# Altium schematic sheet Microcontroller.SchDoc
size A; Organization: Machine Intelligence Laboratory; Address1: 1889 Museum Rd; Address2: Room 3001; Address3: Gainesville, FL, 32611; SheetNumber: 3; SheetTotal: 4
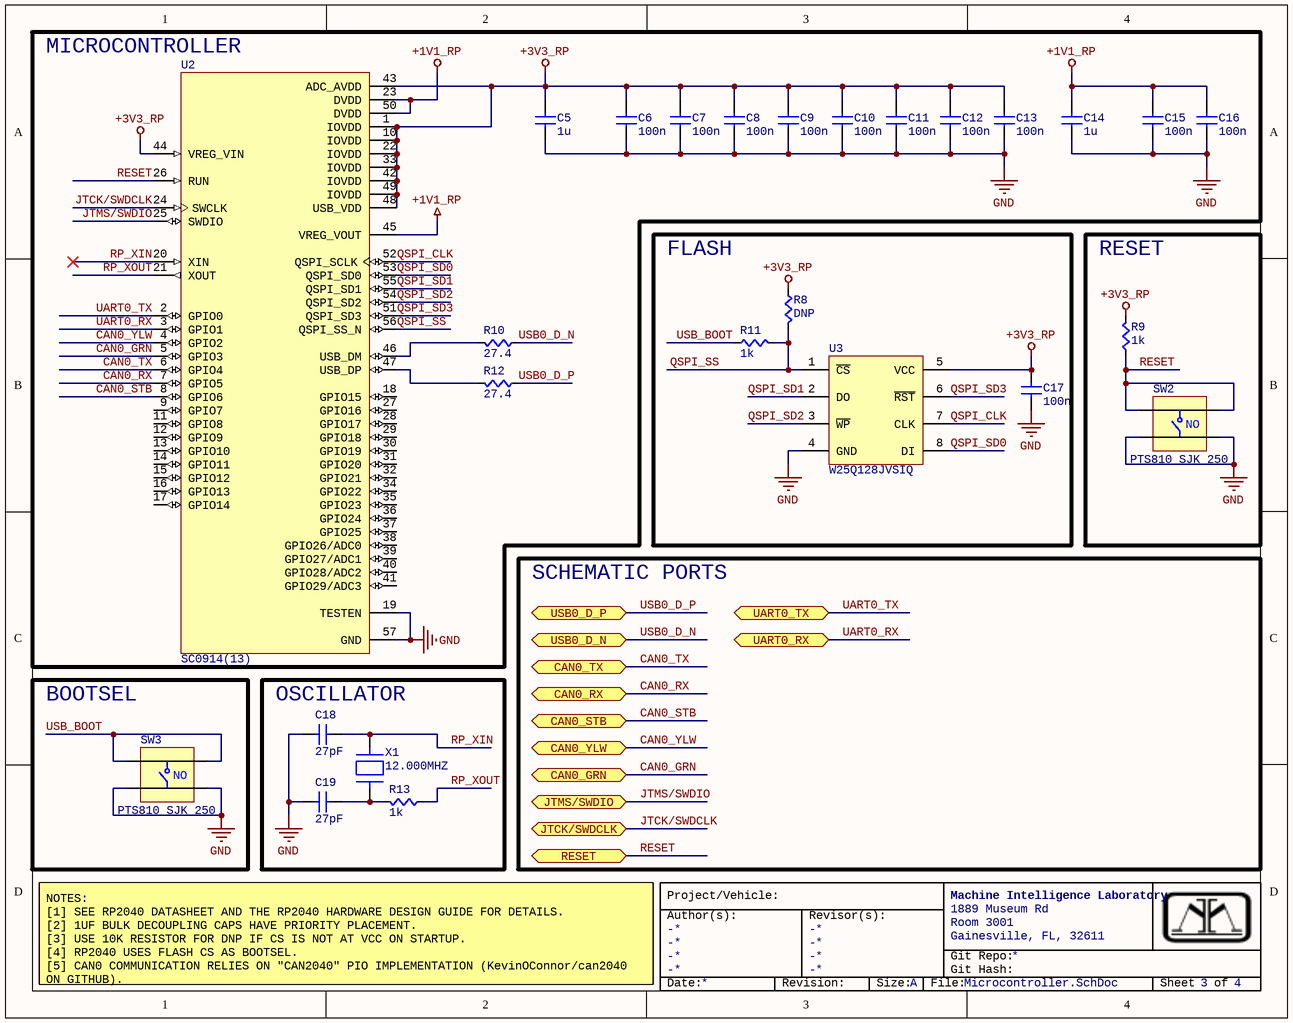
[diagram p0: Microcontroller.SchDoc]

## Parts
C5  value 1u  [CAPC0805]  (hidden comment: Cap)
C6  value 100n  [CAPC0805]  (hidden comment: Cap)
C7  value 100n  [CAPC0805]  (hidden comment: Cap)
C8  value 100n  [CAPC0805]  (hidden comment: Cap)
C9  value 100n  [CAPC0805]  (hidden comment: Cap)
C10  value 100n  [CAPC0805]  (hidden comment: Cap)
C11  value 100n  [CAPC0805]  (hidden comment: Cap)
C12  value 100n  [CAPC0805]  (hidden comment: Cap)
C13  value 100n  [CAPC0805]  (hidden comment: Cap)
C14  value 1u  [CAPC0805]  (hidden comment: Cap)
C15  value 100n  [CAPC0805]  (hidden comment: Cap)
C16  value 100n  [CAPC0805]  (hidden comment: Cap)
C17  value 100n  [CAPC0805]  (hidden comment: Cap)
C18  value 27pF  [CAPC0805]  (hidden comment: Cap)
C19  value 27pF  [CAPC0805]  (hidden comment: Cap)
R8  value DNP  [RES0805]  (hidden comment: Res)
R9  value 1k  [RES0805]  (hidden comment: Res)
R10  value 27.4  [RES0805]  (hidden comment: Res)
R11  value 1k  [RES0805]  (hidden comment: Res)
R12  value 27.4  [RES0805]  (hidden comment: Res)
R13  value 1k  [RES0805]  (hidden comment: Res)
SW2  PTS810 SJK 250  [SW_PTS810_SJM_250_SMTR_LFS]
SW3  PTS810 SJK 250  [SW_PTS810_SJM_250_SMTR_LFS]
U2  SC0914(13)  [QFN40P700X700X90-57N]
U3  W25Q128JVSIQ  [SOIC127P790X216-8N]
X1  12.000MHZ  [ABLS-12.000MHZ]

## Blocks framed on the sheet
MICROCONTROLLER: C5-C16 R10 R12 U2
FLASH: C17 R8 R11 U3
RESET: R9 SW2
BOOTSEL: SW3
OSCILLATOR: C18 C19 R13 X1

## Ports
CAN0_GRN (bidir, see Connectors[5D]), CAN0_RX (bidir, see Transcievers[1C]), CAN0_STB (bidir, see Transcievers[1D]), CAN0_TX (bidir, see Transcievers[1C]), CAN0_YLW (bidir, see Connectors[5D]), JTCK/SWDCLK (bidir, see Connectors[5D]), JTMS/SWDIO (bidir, see Connectors[5D]), RESET (bidir, see Transcievers[1D]), UART0_RX (bidir, see Transcievers[1C]), UART0_TX (bidir, see Transcievers[1C]), USB0_D_N (bidir, see Connectors[5E]), USB0_D_P (bidir, see Connectors[5E])

## Nets
+1V1_RP: C14.1(A) C15.1(A) C16.1(A) U2.23(DVDD) U2.45(VREG_VOUT) U2.50(DVDD)
+3V3_RP: C5.1(A) C6.1(A) C7.1(A) C8.1(A) C9.1(A) C10.1(A) C11.1(A) C12.1(A) C13.1(A) C17.1(A) R8.2(B) R9.1(A) U2.1(IOVDD) U2.10(IOVDD) U2.22(IOVDD) U2.33(IOVDD) U2.42(IOVDD) U2.43(ADC_AVDD) U2.44(VREG_VIN) U2.48(USB_VDD) U2.49(IOVDD) U3.5(VCC)
GND: C5.2(B) C6.2(B) C7.2(B) C8.2(B) C9.2(B) C10.2(B) C11.2(B) C12.2(B) C13.2(B) C14.2(B) C15.2(B) C16.2(B) C17.2(B) C18.1(A) C19.1(A) SW2.3 SW2.4 SW3.3 SW3.4 U2.19(TESTEN) U2.57(GND) U3.4(GND)
CAN0_GRN: U2.5(GPIO3) ; port CAN0_GRN
CAN0_RX: U2.7(GPIO5) ; port CAN0_RX
CAN0_STB: U2.8(GPIO6) ; port CAN0_STB
CAN0_TX: U2.6(GPIO4) ; port CAN0_TX
CAN0_YLW: U2.4(GPIO2) ; port CAN0_YLW
JTCK/SWDCLK: U2.24(SWCLK) ; port JTCK/SWDCLK
JTMS/SWDIO: U2.25(SWDIO) ; port JTMS/SWDIO
QSPI_CLK: U2.52(QSPI_SCLK) U3.7(CLK)
QSPI_SD0: U2.53(QSPI_SD0) U3.8(DI)
QSPI_SD1: U2.55(QSPI_SD1) U3.2(DO)
QSPI_SD2: U2.54(QSPI_SD2) U3.3(~{WP})
QSPI_SD3: U2.51(QSPI_SD3) U3.6(~{RST})
QSPI_SS: R8.1(A) R11.1(A) U2.56(QSPI_SS_N) U3.1(~{CS})
RESET: R9.2(B) SW2.1 SW2.2 U2.26(RUN) ; port RESET
RP_XIN: C18.2(B) U2.20(XIN) X1.1
RP_XOUT: R13.2(B) U2.21(XOUT)
UART0_RX: U2.3(GPIO1) ; port UART0_RX
UART0_TX: U2.2(GPIO0) ; port UART0_TX
USB0_D_N: R10.2(B) ; port USB0_D_N
USB0_D_P: R12.2(B) ; port USB0_D_P
USB_BOOT: R11.2(B) SW3.1 SW3.2
NetC19_2: C19.2(B) R13.1(A) X1.2
NetR10_1: R10.1(A) U2.46(USB_DM)
NetR12_1: R12.1(A) U2.47(USB_DP)

Not connected (* = marked no-connect by the designer): U2 9(GPIO7) 11(GPIO8) 12(GPIO9) 13(GPIO10) 14(GPIO11) 15(GPIO12) 16(GPIO13) 17(GPIO14) 18(GPIO15) 27(GPIO16) 28(GPIO17) 29(GPIO18) 30(GPIO19) 31(GPIO20) 32(GPIO21) 34(GPIO22) 35(GPIO23) 36(GPIO24) 37(GPIO25) 38(GPIO26/ADC0) 39(GPIO27/ADC1) 40(GPIO28/ADC2) 41(GPIO29/ADC3)

## Notes on the sheet
- SCHEMATIC PORTS
- NOTES:
  [1] SEE RP2040 DATASHEET AND THE RP2040 HARDWARE DESIGN GUIDE FOR DETAILS.
  [2] 1UF BULK DECOUPLING CAPS HAVE PRIORITY PLACEMENT.
  [3] USE 10K RESISTOR FOR DNP IF CS IS NOT AT VCC ON STARTUP.
  [4] RP2040 USES FLASH CS AS BOOTSEL.
  [5] CAN0 COMMUNICATION RELIES ON "CAN2040" PIO IMPLEMENTATION (KevinOConnor/can2040 ON GITHUB).
- Project/Vehicle:
- PLACE NOTES BOX HERE
- Author(s):
- -
- Revisor(s):
- Git Repo:
- Git Hash:
- Date:
- Revision:
- Size:
- A
- File:
- Sheet
- of
- (in symbol PTS810 SJK 250 SMTR LFS) NO

## Library data of the parts
SW2 SW3 = PTS810 SJK 250 SMTR LFS: Tactile Switch SPST-NO Top Actuated Surface Mount; Supplier 1: Digikey; Supplier Part Number 1: CKN10503CT-ND
U2 = SC0914(13): ARM® Cortex®-M0+ - Microcontroller IC 32-Bit Dual-Core 133MHz External Program Memory 56-QFN (7x7); MF: Raspberry Pi; SnapEDA_Link: https://www.snapeda.com/parts/SC0914(13)/Raspberry+Pi/view-part/?ref=snap; Package: VFQFN-56 Raspberry Pi; Value: *; MP: SC0914(13); Check_prices: https://www.snapeda.com/parts/SC0914(13)/Raspberry+Pi/view-part/?ref=eda; Supplier 1: Digikey; Supplier Part Number 1: 2648-SC0914(13)CT-ND
U3 = W25Q128JVSIQ: FLASH - NOR Memory IC 128Mbit SPI - Quad I/O, QPI, DTR 133 MHz 8-SOIC
X1 = ABLS-12.000MHZ: 12 MHz ±20ppm Crystal 18pF 50 Ohms HC-49/US; Supplier 1: Digikey; Supplier Part Number 1: 535-9067-1-ND
C5-C19 = Cap: Supplier 1: Digi-Key; Supplier Part Number 1: 1276-1000-1-ND
R8-R13 = Res: Supplier 1: Digi-Key; Supplier Part Number 1: RMCF0603JT10K0CT-ND